# EAGLE design carte_moteurs (EAGLE 5.11)
FARNELL: 1137972
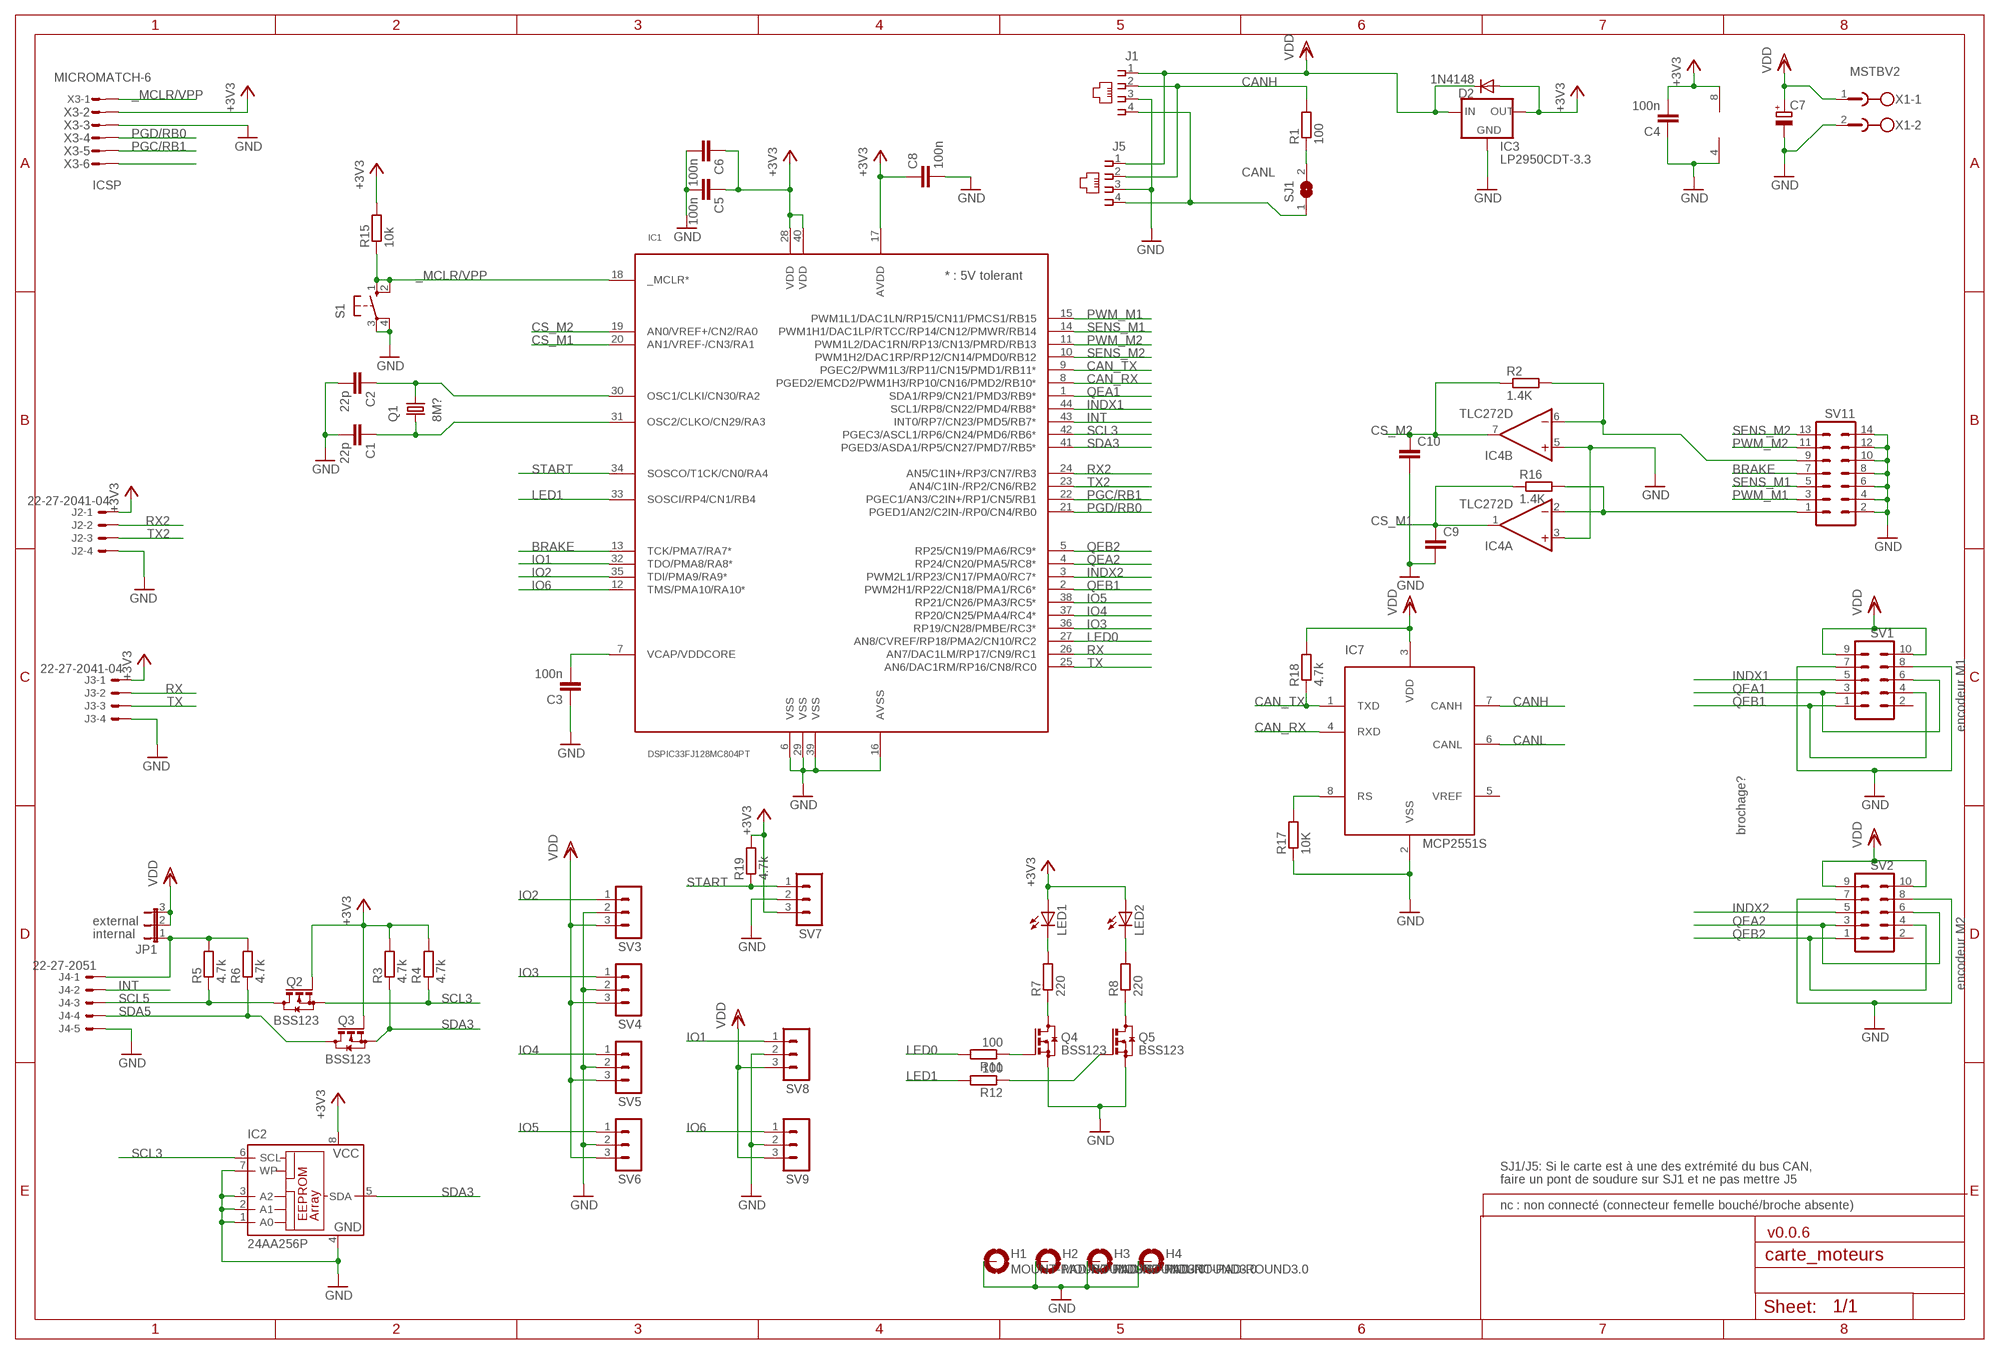
[diagram p0: schematic, sheet 1]

## Parts
C1  22p  C-EUC0603  [C0603]
C2  22p  C-EUC0603  [C0603]
C3  100n  C-EUC0603  [C0603]
C4  100n  C-EUC0603  [C0603]
C5  100n  C-EUC0603  [C0603]
C6  100n  C-EUC0603  [C0603]
C7  CPOL-EUE5-6  [E5-6]
C8  100n  C-EUC0603  [C0603]
C9  C-EUC0603  [C0603]
C10  C-EUC0603  [C0603]
D2  1N4148  1N4148DO35-7  [DO35-7]
H1  MOUNT-PAD-ROUND3.0  [3,0-PAD]
H2  MOUNT-PAD-ROUND3.0  [3,0-PAD]
H3  MOUNT-PAD-ROUND3.0  [3,0-PAD]
H4  MOUNT-PAD-ROUND3.0  [3,0-PAD]
IC1  DSPIC33FJ128MC804PT  [TQFP44]
IC2  24AA256P  [DIL8]
IC3  LP2950CDT-3.3  [DPACK]
IC4  TLC272D  [SO08]
IC7  MCP2551S  [SO-08]
J1  215876-6  [215876-6]
J2  22-27-2041-04  [6410-04]
J3  22-27-2041-04  [6410-04]
J4  22-27-2051  22-27-2051-05  [6410-05]
J5  215876-6  [215876-6]
JP1  JP2E  [JP2]
LED1  LED3MM  [LED3MM]
LED2  LED3MM  [LED3MM]
Q1  8M?  CRYSTALSM49  [SM49]
Q2  BSS123  [SOT23]
Q3  BSS123  [SOT23]
Q4  BSS123  [SOT23]
Q5  BSS123  [SOT23]
R1  100  R-EU_R0805  [R0805]
R2  1.4K  R-EU_R0805  [R0805]
R3  4.7k  R-EU_R0805  [R0805]
R4  4.7k  R-EU_R0805  [R0805]
R5  4.7k  R-EU_0204/7  [0204/7]
R6  4.7k  R-EU_0204/7  [0204/7]
R7  220  R-EU_R0805  [R0805]
R8  220  R-EU_R0805  [R0805]
R11  100  R-EU_R0805  [R0805]
R12  100  R-EU_R0805  [R0805]
R15  10k  R-EU_R0805  [R0805]
R16  1.4K  R-EU_R0805  [R0805]
R17  10K  R-EU_R0805  [R0805]
R18  4.7k  R-EU_R0805  [R0805]
R19  4.7k  R-EU_R0805  [R0805]
S1  10-XX  [B3F-10XX]
SJ1  SJ  [SJ]
SV1  MA05-2W  [MA05-2W]
SV2  MA05-2W  [MA05-2W]
SV3  MA03-1  [MA03-1]
SV4  MA03-1  [MA03-1]
SV5  MA03-1  [MA03-1]
SV6  MA03-1  [MA03-1]
SV7  MA03-1  [MA03-1]
SV8  MA03-1  [MA03-1]
SV9  MA03-1  [MA03-1]
SV11  ML14L  [ML14L]
X1  MSTBV2  [MSTBV2]
X3  MICROMATCH-6  [MICROMATCH-6]

## Nets
+3V3: C4.2 C5.1 C6.1 C8.1 D2.A IC1.17(AVDD) IC1.28(VDD) IC1.40(VDD) IC2.8(VCC) IC3.3(OUT) IC4.8(P:V+) J2.1 J3.1 LED1.A LED2.A Q2.1(G) Q3.1(G) R3.2 R4.2 R15.2 R19.2 SV7.3 X3.2
_MCLR/VPP: IC1.18(_MCLR*) R15.1 S1.1(S) S1.2(S1) X3.1
BRAKE: IC1.13(TCK/PMA7/RA7*) SV11.7
CAN_RX: IC1.8(PGED2/EMCD2/PWM1H3/RP10/CN16/PMD2/RB10*) IC7.4(RXD)
CAN_TX: IC1.9(PGEC2/PWM1L3/RP11/CN15/PMD1/RB11*) IC7.1(TXD) R18.1
CANH: IC7.7(CANH) J1.2 J5.2 R1.2
CANL: IC7.6(CANL) J1.4 J5.4 SJ1.1
CS_M1: C9.1 IC1.20(AN1/VREF-/CN3/RA1) IC4.1(A:OUT) R16.1
CS_M2: C10.1 IC1.19(AN0/VREF+/CN2/RA0) IC4.7(B:OUT) R2.1
GND: C1.2 C2.2 C3.1 C4.1 C5.2 C6.2 C7.- C8.2 C9.2 C10.2 H1.B3,0(MOUNT) H2.B3,0(MOUNT) H3.B3,0(MOUNT) H4.B3,0(MOUNT) IC1.6(VSS) IC1.16(AVSS) IC1.29(VSS) IC1.39(VSS) IC2.1(A0) IC2.2(A1) IC2.3(A2) IC2.4(GND) IC2.7(WP) IC3.4(GND) IC4.3(A:+IN) IC4.4(P:V-) IC4.5(B:+IN) IC7.2(VSS) J1.3 J2.4 J3.4 J4.5 J5.3 Q4.2(S) Q5.2(S) R17.1 S1.3(P) S1.4(P1) SV1.7 SV1.8 SV2.7 SV2.8 SV3.2 SV4.2 SV5.2 SV6.2 SV7.2 SV8.2 SV9.2 SV11.2 SV11.4 SV11.6 SV11.8 SV11.10 SV11.12 SV11.14 X1.2 X3.3
INDX1: IC1.44(SCL1/RP8/CN22/PMD4/RB8*) SV1.5
INDX2: IC1.3(PWM2L1/RP23/CN17/PMA0/RC7*) SV2.5
INT: IC1.43(INT0/RP7/CN23/PMD5/RB7*) J4.2
IO1: IC1.32(TDO/PMA8/RA8*) SV8.1
IO2: IC1.35(TDI/PMA9/RA9*) SV3.1
IO3: IC1.36(RP19/CN28/PMBE/RC3*) SV4.1
IO4: IC1.37(RP20/CN25/PMA4/RC4*) SV5.1
IO5: IC1.38(RP21/CN26/PMA3/RC5*) SV6.1
IO6: IC1.12(TMS/PMA10/RA10*) SV9.1
LED0: IC1.27(AN8/CVREF/RP18/PMA2/CN10/RC2) R11.2
LED1: IC1.33(SOSCI/RP4/CN1/RB4) R12.2
N$1: J4.1 JP1.1 R5.2 R6.2
N$2: IC4.2(A:-IN) R16.2 SV11.1
N$4: C1.1 IC1.31(OSC2/CLKO/CN29/RA3) Q1.1
N$5: Q4.3(D) R7.1
N$6: Q4.1(G) R11.1
N$9: Q5.3(D) R8.1
N$10: IC4.6(B:-IN) R2.2 SV11.9
N$11: IC7.8(RS) R17.2
N$15: C2.1 IC1.30(OSC1/CLKI/CN30/RA2) Q1.2
N$19: X3.6
N$21: Q5.1(G) R12.1
N$23: C3.2 IC1.7(VCAP/VDDCORE)
N$33: LED2.K(C) R8.2
N$34: LED1.K(C) R7.2
N$41: R1.1 SJ1.2
PGC/RB1: IC1.22(PGEC1/AN3/C2IN+/RP1/CN5/RB1) X3.5
PGD/RB0: IC1.21(PGED1/AN2/C2IN-/RP0/CN4/RB0) X3.4
PWM_M1: IC1.15(PWM1L1/DAC1LN/RP15/CN11/PMCS1/RB15) SV11.3
PWM_M2: IC1.11(PWM1L2/DAC1RN/RP13/CN13/PMRD/RB13) SV11.11
QEA1: IC1.1(SDA1/RP9/CN21/PMD3/RB9*) SV1.3 SV1.6
QEA2: IC1.4(RP24/CN20/PMA5/RC8*) SV2.3 SV2.6
QEB1: IC1.2(PWM2H1/RP22/CN18/PMA1/RC6*) SV1.1 SV1.4
QEB2: IC1.5(RP25/CN19/PMA6/RC9*) SV2.1 SV2.4
RX: IC1.26(AN7/DAC1LM/RP17/CN9/RC1) J3.2
RX2: IC1.24(AN5/C1IN+/RP3/CN7/RB3) J2.2
SCL3: IC1.42(PGEC3/ASCL1/RP6/CN24/PMD6/RB6*) IC2.6(SCL) Q2.2(S) R4.1
SCL5: J4.3 Q2.3(D) R5.1
SDA3: IC1.41(PGED3/ASDA1/RP5/CN27/PMD7/RB5*) IC2.5(SDA) Q3.2(S) R3.1
SDA5: J4.4 Q3.3(D) R6.1
SENS_M1: IC1.14(PWM1H1/DAC1LP/RTCC/RP14/CN12/PMWR/RB14) SV11.5
SENS_M2: IC1.10(PWM1H2/DAC1RP/RP12/CN14/PMD0/RB12) SV11.13
START: IC1.34(SOSCO/T1CK/CN0/RA4) R19.1 SV7.1
TX: IC1.25(AN6/DAC1RM/RP16/CN8/RC0) J3.3
TX2: IC1.23(AN4/C1IN-/RP2/CN6/RB2) J2.3
VDD: C7.+ D2.C IC3.1(IN) IC7.3(VDD) J1.1 J5.1 JP1.2 JP1.3 R18.2 SV1.9 SV1.10 SV2.9 SV2.10 SV3.3 SV4.3 SV5.3 SV6.3 SV8.3 SV9.3 X1.1
Unconnected: IC7.5(VREF) SV1.2 SV2.2

## Notes on the sheet
- ICSP
- encodeur M1
- brochage?
- external
- internal
- encodeur M2
- SJ1/J5: Si le carte est à une des extrémité du bus CAN,
- faire un pont de soudure sur SJ1 et ne pas mettre J5
- nc : non connecté (connecteur femelle bouché/broche absente)
- v0.0.6

## Library data of the parts
C1-C6 C8-C10 = rcl:C-EU: CAPACITOR, European symbol
C7 = rcl:CPOL-EU: POLARIZED CAPACITOR, European symbol
D2 = diode:1N4148: DIODE high speed (Philips)
H1-H4 = holes:MOUNT-PAD-ROUND: MOUNTING PAD, round
IC1 = microchip-dspic33:DSPIC33F*04
IC2 = microchip:24*: Serial EEPROM I2C; MF: MICROCHIP; MPN: 24AA256-I/P; OC_FARNELL: 1331294; OC_NEWARK: 92C6872
IC3 = v-reg:LP2950?*: Source: http://cache.national.com/ds/LP/LP2950.pdf
IC4 = linear:TLC272: OP AMP
IC7 = microchip:MCP2551
J1 J5 = con-amp:215876-6: AMP connector
J2 J3 = con-molex:22-?-04: CONNECTOR wire to board 2.54 mm (.1 inch) pitch header; OC_FARNELL: unknown; OC_NEWARK: unknown
J4 = con-molex:22-?-05: CONNECTOR wire to board 2.54 mm (.1 inch) pitch header; OC_FARNELL: unknown; OC_NEWARK: unknown
JP1 = jumper:JP2E: JUMPER
LED1 LED2 = led:LED: LED OSRAM: - CHIPLED LG R971, LG N971, LY N971, LG Q971, LY Q971, LO R971, LY R971 LH N974, LH R974 LS Q976, LO Q976, LY Q976 LO Q996 - Hyper CHIPLED LW Q18S LB Q993, LB Q99A, LB R99A - SideLED LS A670, LO A670, LY A670, LG A670, LP A670 LB A673, LV A673, LT A673, LW A673 LH A674 LY A675 LS A676, LA A676, LO A676, LY A676, LW A676 LS A679, LY A679, LG A679 - Hyper Micro SIDELED® LS Y876, LA Y876, LO Y876, LY Y876 LT Y87S - SmartLED LW L88C, LW L88S LB L89C, LB L89S, LG L890 LS L89K, LO L89K, LY L89K LS L896, LA L896, LO L896, LY L896 - TOPLED LS T670, LO T670, LY T670, LG T670, LP T670 LSG T670, LSP T670, LSY T670, LOP T670, LYG T670 LG T671, LOG T671, LSG T671 LB T673, LV T673, LT T673, LW T673 LH T674 LS T676, LA T676, LO T676, LY T676, LB T676, LH T676, LSB T676, LW T676 LB T67C, LV T67C, LT T67C, LS T67K, LO T67K, LY T67K, LW E67C LS E67B, LA E67B, LO E67B, LY E67B, LB E67C, LV E67C, LT E67C LW T67C LS T679, LY T679, LG T679 LS T770, LO T770, LY T770, LG T770, LP T770 LB T773, LV T773, LT T773, LW T773 LH T774 LS E675, LA E675, LY E675, LS T675 LS T776, LA T776, LO T776, LY T776, LB T776 LHGB T686 LT T68C, LB T68C - Hyper Mini TOPLED® LB M676 - Mini TOPLED Santana® LG M470 LS M47K, LO M47K, LY M47K Source: http://www.osram.convergy.de LUXEON: - LUMILED® LXK2-PW12-R00, LXK2-PW12-S00, LXK2-PW14-U00, LXK2-PW14-V00 LXK2-PM12-R00, LXK2-PM12-S00, LXK2-PM14-U00 LXK2-PE12-Q00, LXK2-PE12-R00, LXK2-PE12-S00, LXK2-PE14-T00, LXK2-PE14-U00 LXK2-PB12-K00, LXK2-PB12-L00, LXK2-PB12-M00, LXK2-PB14-N00, LXK2-PB14-P00, LXK2-PB14-Q00 LXK2-PR12-L00, LXK2-PR12-M00, LXK2-PR14-Q00, LXK2-PR14-R00 LXK2-PD12-Q00, LXK2-PD12-R00, LXK2-PD12-S00 LXK2-PH12-R00, LXK2-PH12-S00 LXK2-PL12-P00, LXK2-PL12-Q00, LXK2-PL12-R00 Source: www.luxeon.com KINGBRIGHT: KA-3528ASYC Source: www.kingbright.com
Q1 = crystal:CRYSTAL: CRYSTAL; OC_FARNELL: unknown; OC_NEWARK: unknown
Q2-Q5 = transistor-small-signal:BSS123: N-CHANNEL MOS FET
R1-R8 R11 R12 R15-R19 = rcl:R-EU_: RESISTOR, European symbol
S1 = switch-omron:10-XX: OMRON SWITCH; MPN: B3F-1000; OC_FARNELL: 176432; OC_NEWARK: 36M3542
SJ1 = jumper:SJ: SMD solder JUMPER
SV1 SV2 = con-lstb:MA05-2: PIN HEADER
SV3-SV9 = con-lstb:MA03-1: PIN HEADER; OC_FARNELL: unknown; OC_NEWARK: unknown
SV11 = con-harting-ml:ML14: HARTING; OC_FARNELL: unknown; OC_NEWARK: unknown
X1 = con-phoenix-508:MSTBV2: PHOENIX; MPN: MSTBV 2,5/2-GF-5.08; OC_FARNELL: 1792792; OC_NEWARK: 69R9845
X3 = con-amp-micromatch:MICROMATCH-6: MicroMaTch 6 7-215464-6 / 0-215464-6 Drawing Number C-215464 DDEController.pdf; MPN: 7-215464-6; OC_FARNELL: 3784630; OC_NEWARK: 19R8125

## Board
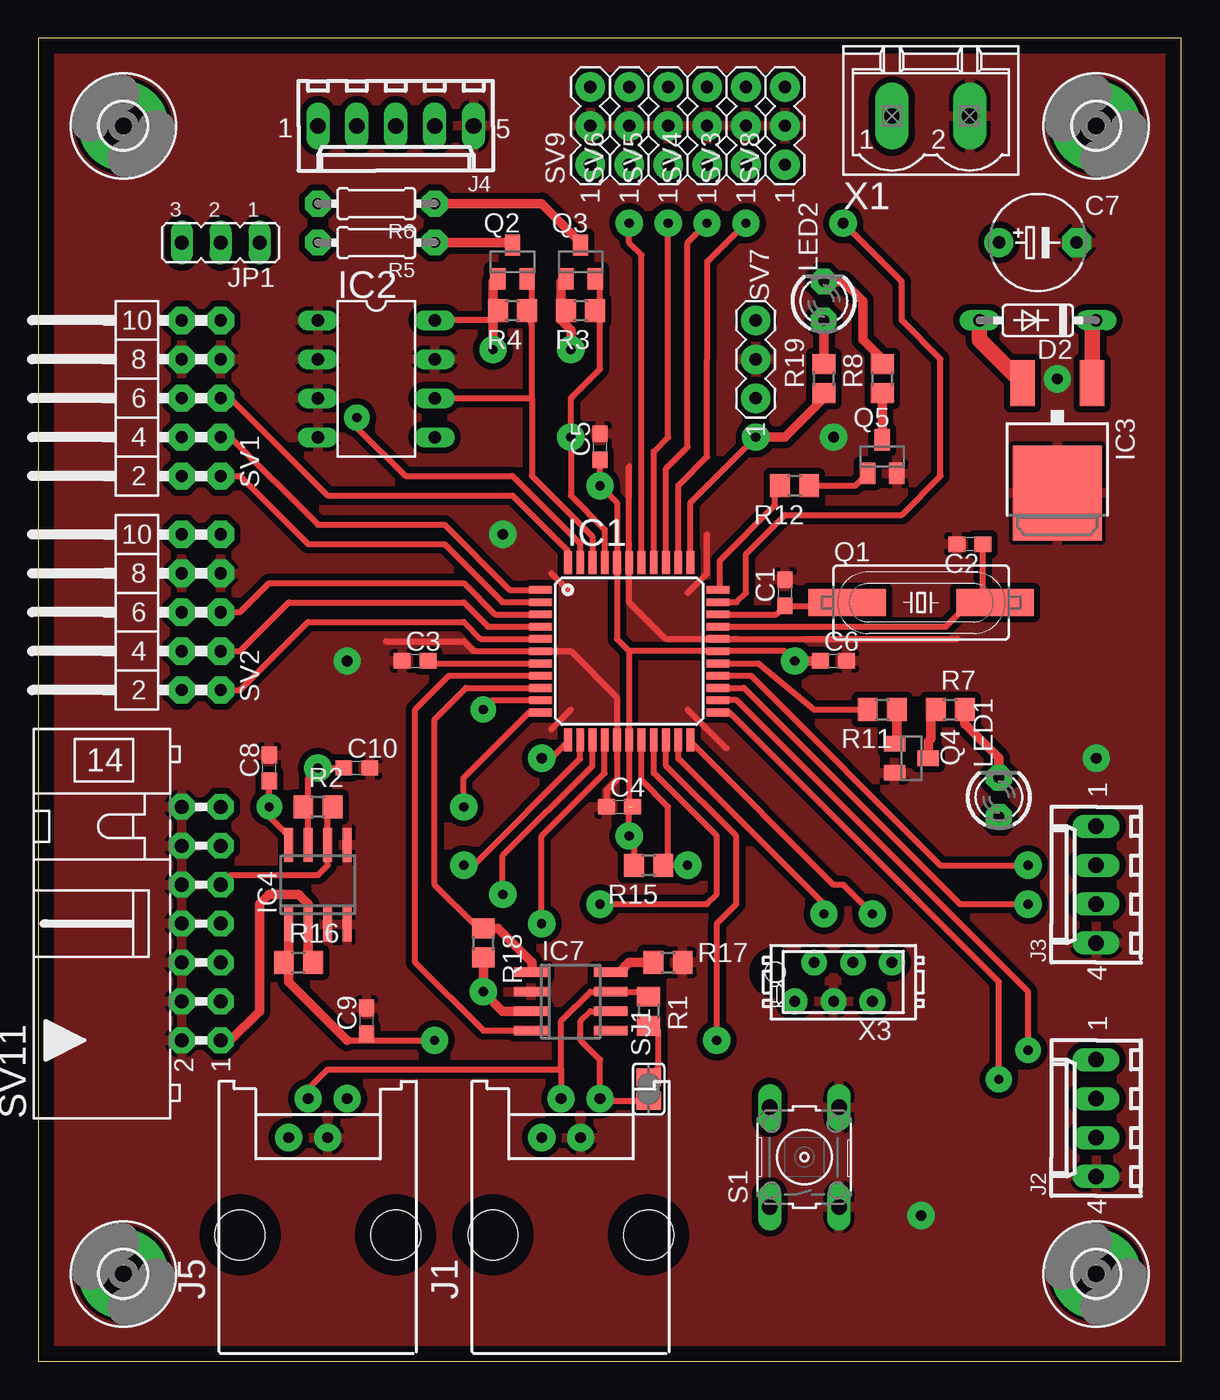
[diagram p1: board, top side]
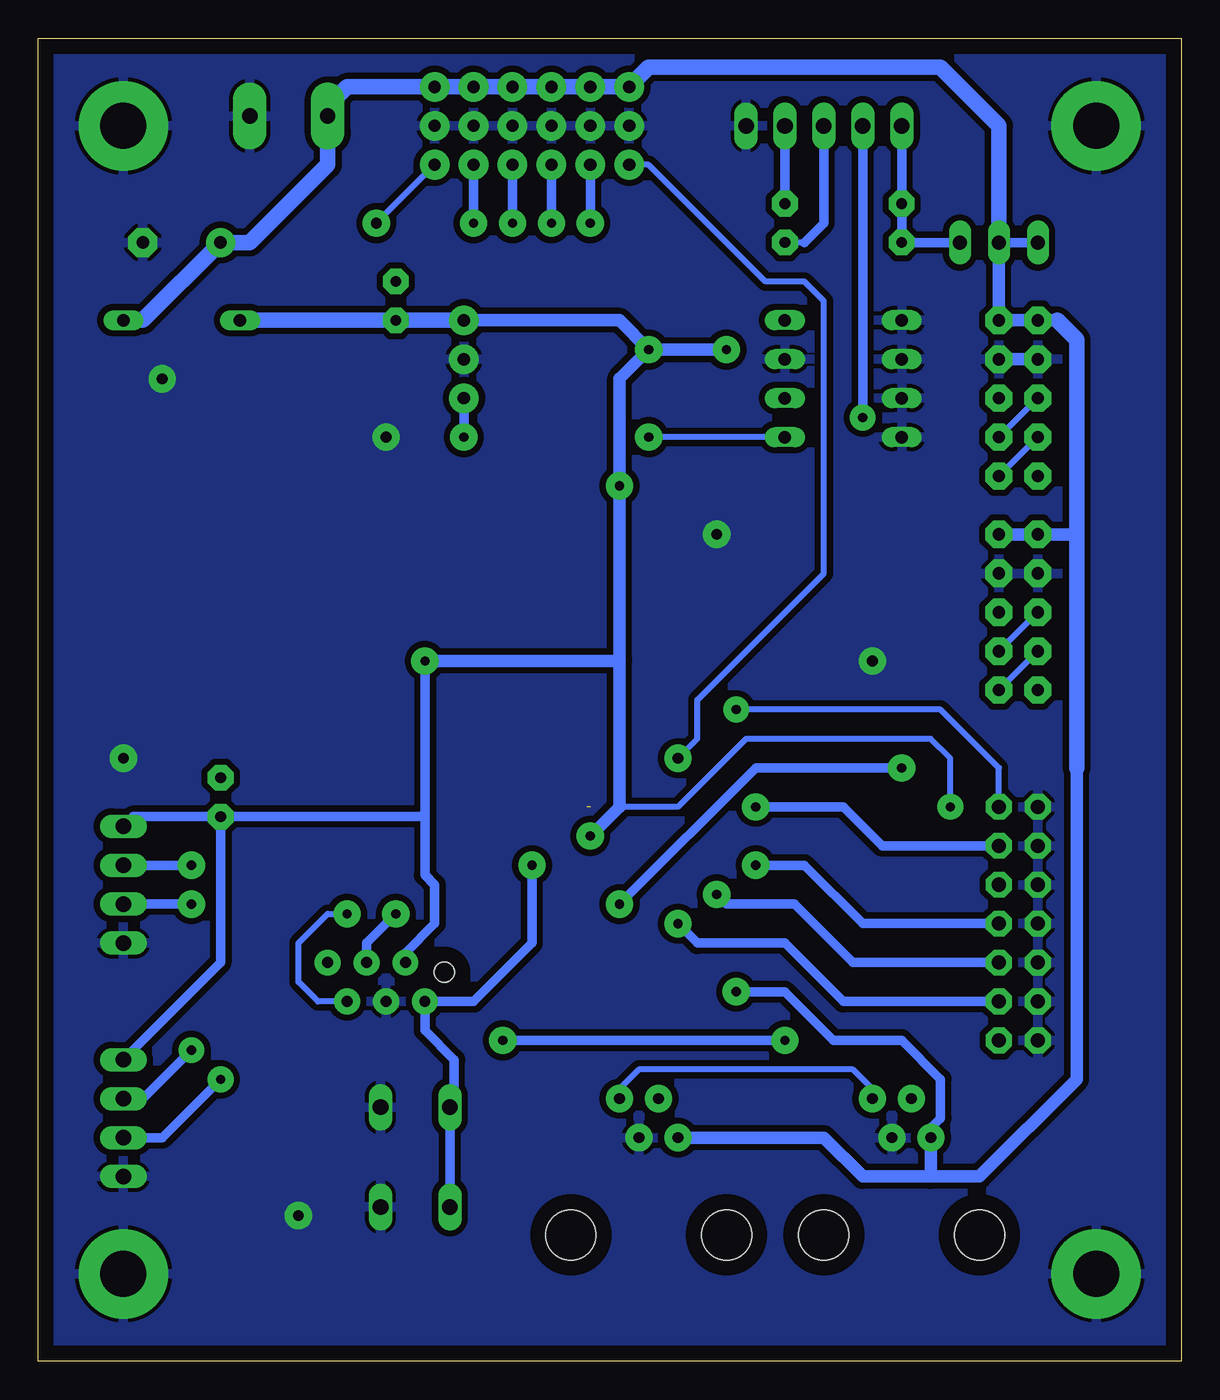
[diagram p2: board, bottom side, seen from below]

Size 74.6 x 86.34 mm. Coordinates in mm from the lower left corner, seen from the top.
Outline: 0,86.34 0,0 74.6,0 74.6,86.34 0,86.34
Copper layers (1*16): Top 0.035mm / dielectric 1.5mm / Bottom 0.035mm
Design rules "default *": minimum track width 10mil, minimum drill 0.6mm, track to track 8mil, track to pad 8mil, pad to pad 8mil, via to via 8mil, smd to smd 8mil, copper to edge 40mil, drill to drill 8mil, minimum pad ring 10mil, minimum via ring 8mil, stop-mask expansion 4mil, vias tented up to drill 0mil, thermal gap 10mil
Holes 1.3 mm at 48.09,25.39

### Footprints (pad centres in the part's own frame; a part is rotated, then mirrored left to right if it is on the bottom)
C0603 = smd 1.1 x 1: 1 -0.85,0; 2 0.85,0
E5-6 = drill 0.813 pad 1.905 round: + -2.54,0 | drill 0.813 pad 1.905 octagon: - 2.54,0
DO35-7 = drill 0.813 long: A 3.81,0; C -3.81,0
3,0-PAD = drill 3 pad 5.842 round: B3,0 0,0
TQFP44 = smd 1.5 x 0.5: 1 -5.8,4; 2 -5.8,3.2; 3 -5.8,2.4; 4 -5.8,1.6; 5 -5.8,0.8; 6 -5.8,0; 7 -5.8,-0.8; 8 -5.8,-1.6; 9 -5.8,-2.4; 10 -5.8,-3.2; 11 -5.8,-4; 23 5.8,-4; 24 5.8,-3.2; 25 5.8,-2.4; 26 5.8,-1.6; 27 5.8,-0.8; 28 5.8,0; 29 5.8,0.8; 30 5.8,1.6; 31 5.8,2.4; 32 5.8,3.2; 33 5.8,4 | smd 0.5 x 1.5: 12 -4,-5.8; 13 -3.2,-5.8; 14 -2.4,-5.8; 15 -1.6,-5.8; 16 -0.8,-5.8; 17 0,-5.8; 18 0.8,-5.8; 19 1.6,-5.8; 20 2.4,-5.8; 21 3.2,-5.8; 22 4,-5.8; 34 4,5.8; 35 3.2,5.8; 36 2.4,5.8; 37 1.6,5.8; 38 0.8,5.8; 39 0,5.8; 40 -0.8,5.8; 41 -1.6,5.8; 42 -2.4,5.8; 43 -3.2,5.8; 44 -4,5.8
DIL8 = drill 0.813 long: 1 -3.81,-3.81; 2 -1.27,-3.81; 3 1.27,-3.81; 4 3.81,-3.81; 5 3.81,3.81; 6 1.27,3.81; 7 -1.27,3.81; 8 -3.81,3.81
DPACK = smd 1.6 x 3: 1 -2.28,-4.8; 3 2.28,-4.8 | smd 5.8 x 6.2: 4 0,2.38
SO08 = smd 0.6 x 2.2: 1 -1.905,-2.6; 2 -0.635,-2.6; 3 0.635,-2.6; 4 1.905,-2.6; 5 1.905,2.6; 6 0.635,2.6; 7 -0.635,2.6; 8 -1.905,2.6
SO-08 = smd 0.6 x 2.2: 1 -1.905,-2.6; 2 -0.635,-2.6; 3 0.635,-2.6; 4 1.905,-2.6; 5 1.905,2.6; 6 0.635,2.6; 7 -0.635,2.6; 8 -1.905,2.6
215876-6 = drill 0.7 pad 1.778 round: 1 -1.905,6.35; 2 -0.635,8.89; 3 0.635,6.35; 4 1.905,8.89 | hole 3.251: -5.08,0; 5.08,0
6410-04 = drill 1.016 long: 1 3.81,0; 2 1.27,0; 3 -1.27,0; 4 -3.81,0
6410-05 = drill 1.016 long: 1 5.08,0; 2 2.54,0; 3 0,0; 4 -2.54,0; 5 -5.08,0
JP2 = drill 0.914 long: 1 -2.54,0; 2 0,0; 3 2.54,0
LED3MM = drill 0.7 pad 1.676 octagon: A -1.27,0; K 1.27,0
SM49 = smd 5.08 x 1.778: 1 -4.826,0; 2 4.826,0
SOT23 = smd 1 x 1.4: 1 -0.95,-1.1; 2 0.95,-1.1; 3 0,1.1
R0805 = smd 1.3 x 1.5: 1 -0.95,0; 2 0.95,0
0204/7 = drill 0.7 pad 1.676 octagon: 1 -3.81,0; 2 3.81,0
B3F-10XX = drill 1.016 long: 1 -3.251,2.261; 2 3.251,2.261; 3 -3.251,-2.261; 4 3.251,-2.261
SJ = smd 1.168 x 1.6: 1 -0.762,0; 2 0.762,0
MA05-2W = drill 0.8 pad 1.778 octagon: 1 -5.08,-1.27; 2 -5.08,1.27; 3 -2.54,-1.27; 4 -2.54,1.27; 5 0,-1.27; 6 0,1.27; 7 2.54,-1.27; 8 2.54,1.27; 9 5.08,-1.27; 10 5.08,1.27
MA03-1 = drill 0.8 pad 1.93 round: 1 -2.54,0; 2 0,0; 3 2.54,0
ML14L = drill 0.914 pad 1.676 octagon: 1 -7.62,-1.27; 2 -7.62,1.27; 3 -5.08,-1.27; 4 -5.08,1.27; 5 -2.54,-1.27; 6 -2.54,1.27; 7 0,-1.27; 8 0,1.27; 9 2.54,-1.27; 10 2.54,1.27; 11 5.08,-1.27; 12 5.08,1.27; 13 7.62,-1.27; 14 7.62,1.27
MSTBV2 = drill 1 pad 2.184 long: 1 -2.54,0; 2 2.54,0
MICROMATCH-6 = drill 0.7 pad 1.676 round: 1 3.175,1.27; 2 1.905,-1.27; 3 0.635,1.27; 4 -0.635,-1.27; 5 -1.905,1.27; 6 -3.175,-1.27

### Placement (x,y rotation side)
C1  48.73,50.15 90 top
C2  60.8,53.32 180 top
C3  24.6,45.7 0 top
C4  37.94,36.18 0 top
C5  36.66,59.67 90 top
C6  51.91,45.7 0 top
C7  65.24,73.01 0 top
C8  15.08,38.72 90 top
C9  21.42,22.21 90 top
C10  20.79,38.72 0 top
D2  65.24,67.93 180 top
H1  5.55,80.63 270 top
H2  69.05,5.7 270 top
H3  69.05,80.63 270 top
H4  5.55,5.7 270 top
IC1  38.57,46.34 0 top
IC2  22.06,64.12 270 top
IC3  66.51,59.04 180 top
IC4  18.25,31.1 0 top
IC7  34.76,23.48 270 top
J1  34.76,8.24 0 top
J2  69.05,15.86 90 top
J3  69.05,31.1 90 top
J4  23.33,80.63 180 top
J5  18.25,8.24 0 top
JP1  11.9,73.01 180 top
LED1  62.7,36.81 90 top
LED2  51.27,69.2 90 top
Q1  57.62,49.52 0 top
Q2  30.95,71.74 0 top
Q3  35.39,71.74 0 top
Q4  56.98,39.35 270 top
Q5  55.08,59.04 0 top
R1  39.84,22.85 90 top
R2  18.25,36.18 0 top
R3  35.39,68.56 180 top
R4  30.95,68.56 180 top
R5  22.06,73.01 180 top
R6  22.06,75.55 180 top
R7  59.52,42.53 0 top
R8  55.08,64.12 90 top
R11  55.08,42.53 180 top
R12  49.37,57.13 180 top
R15  39.84,32.37 180 top
R16  16.98,26.02 0 top
R17  41.11,26.02 180 top
R18  29.04,27.29 270 top
R19  51.27,64.12 90 top
S1  50,13.32 90 top
SJ1  39.84,17.77 90 top
SV1  10.63,62.85 90 top
SV2  10.63,48.88 90 top
SV3  46.19,80.63 90 top
SV4  43.65,80.63 90 top
SV5  41.11,80.63 90 top
SV6  38.57,80.63 90 top
SV7  46.82,65.39 90 top
SV8  48.73,80.63 90 top
SV9  36.03,80.63 90 top
SV11  10.63,28.56 90 top
X1  58.25,81.27 0 top
X3  52.54,24.75 180 top

### Tracks (layer width: path | path; a pad name or v marks a point on that pad's centre or on a via)
+3V3  (via drill 0.6 pad 1.68, 0.6 pad 1.78)  (1 unrouted)
  Top 0.406: 38.57,46.34 37.77,47.14 IC1.40 37.77,56.03 v36.66,57.13 C5.1 | 38.57,46.34 IC1.17 38.57,36.39 | 38.57,46.34 IC1.28 48.73,46.34 v49.37,45.7 | 29.68,67.93 30,68.25 | 34.45,68.25 34.12,67.93 R3.2 | Q2.1 29.85,70.64 29.68,70.47 | Q3.1 34.3,70.64 34.12,70.47 | 29.68,67.93 R4.2 | R15.2 38.89,33.95 v38.57,34.27 38.57,36.18 | 29.68,67.93 IC2.8 | IC4.8 16.34,34.27 15.08,35.54 v15.08,36.18 C8.1
  Top 0.61: 29.68,70.47 29.68,67.93 v29.68,66.03 | 34.12,70.47 34.12,67.93 34.76,67.3 v34.76,66.03 | v49.37,45.7 C6.1 | LED2.A R19.2
  Top 1.016: IC3.3 64.23,63.86 61.43,66.66 D2.A
  Bottom 0.406: v15.08,36.18 15.08,39.35 16.34,40.62 28.41,40.62 32.85,36.18 36.66,36.18
  Bottom 0.61: v49.37,45.7 49.37,35.54 | 49.37,35.54 49.37,31.73 48.73,31.1 48.73,28.56 50.63,26.66 X3.2 | J2.1 62.7,26.02 LED1.A | 49.37,35.54 LED1.A | J3.1 68.41,35.54 LED1.A
  Bottom 0.813: v38.57,34.27 36.66,36.18 36.66,45.7 | 36.66,45.7 v36.66,57.13 36.66,64.12 v34.76,66.03 | 36.66,45.7 v49.37,45.7 | v34.76,66.03 v29.68,66.03 | SV7.3 36.66,67.93 v34.76,66.03
  Bottom 1.016: SV7.3 LED2.A D2.A
_MCLR/VPP  (via drill 0.6 pad 1.78)
  Top 0.406: IC1.18 39.37,37.92 41.11,36.18 41.11,32.69 | v42.38,32.37 41.11,32.37 41.11,32.69 | 41.11,32.69 R15.1
  Bottom 0.406: 47.74,16.85 47.46,17.13
  Bottom 0.61: S1.1 S1.2 47.74,16.85 | v42.38,32.37 42.38,27.29 46.19,23.48 X3.1 49.37,21.57 47.46,19.67 47.46,17.13
BRAKE  (via drill 0.6 pad 1.78)
  Top 0.406: IC1.13 35.37,39.33 28.41,32.37 v27.77,32.37
  Bottom 0.61: SV11.7 20.79,28.56 24.6,32.37 v27.77,32.37
CAN_RX
  Top 0.406: IC7.4 29.04,21.57 24.6,26.02 24.6,42.53 26.81,44.74 IC1.8
CAN_TX
  Top 0.406: R18.1 28.98,28.3 28.66,28.3 25.87,31.1 25.87,41.89 27.91,43.94 IC1.9 | 32.22,25.45 IC7.1
  Top 0.61: R18.1 30,28.24 32.22,26.02 32.22,25.45 32.22,25.39
CANH
  Top 0.406: R1.2 39.52,24.12 IC7.7 36.03,24.12 34.12,22.21 34.12,19.04 | 34.12,19.04 18.88,19.04 17.61,17.77 J5.2 | 34.12,19.04 J1.2
CANL
  Top 0.406: IC7.6 36.03,22.85 35.39,22.21 35.39,20.94 36.66,19.67 J1.4 36.79,17 SJ1.1
  Bottom 0.406: J5.4 20.15,17.77 21.42,19.04 35.39,19.04 36.66,17.77 J1.4
CS_M1  (via drill 0.6 pad 1.78)
  Top 0.406: 16.34,25.7 R16.1 | IC1.20 40.97,38.86 45.55,34.27 45.55,29.83 44.28,28.56 v44.28,20.94 | 21.42,20.94 v25.87,20.94 | 21.21,20.94 C9.1 21.42,20.94 | 20.15,20.94 21.21,20.94 | 21.21,20.94 21.42,20.94
  Top 0.61: IC4.1 16.34,25.7 16.34,24.75 20.15,20.94
  Bottom 0.61: v25.87,20.94 v44.28,20.94
CS_M2  (via drill 0.6 pad 1.78)
  Top 0.406: IC4.7 17.61,35.86 | 17.61,35.86 R2.1 | IC1.19 40.17,38.39 44.28,34.27 44.28,30.46 43.65,29.83 v36.66,29.83 | 17.61,35.86 17.61,38.09 v18.25,38.72 C10.1
  Bottom 0.61: v18.25,38.72 27.77,38.72 v36.66,29.83
GND  (via drill 0.7 pad 1.78)
  Top 0.406: 59.99,47.14 IC1.29 40.95,47.14 38.57,49.52 IC1.39 38.57,58.4 | 42.38,50.15 43.65,51.42 43.65,53.96 | 44.92,39.99 42.38,42.53 | 34.76,50.15 33.49,51.42 | 34.76,42.53 33.49,41.26 | 22.7,46.97 27.77,46.97 28.41,46.34 IC1.6 34.76,46.34 37.77,43.33 IC1.16 37.77,37.92 37.09,37.23 C4.1
  Bottom 0.813: SV1.8 SV1.7
  other vias: 20.15,45.7 69.05,39.35 57.62,9.51 66.51,64.12 51.91,60.31 30.31,53.96
  pour Top (isolate 0.406): 74.13,85.71 74.13,0.62 0.47,0.62 0.47,85.71
  pour Bottom (isolate 0.406): 0.47,85.71 74.13,85.71 74.13,0.62 0.47,0.62
INDX1
  Top 0.406: IC1.44 34.57,52.88 30.95,56.5 18.88,56.5 12.54,62.85 SV1.5
INDX2
  Top 0.406: IC1.3 29.82,48.74 27.77,50.78 15.08,50.78 13.17,48.88 SV2.5
INT  (via drill 0.6 pad 1.68)
  Top 0.406: IC1.43 35.37,53.35 30.95,57.77 23.96,57.77 20.79,60.95 v20.79,61.58
  Bottom 0.61: v20.79,61.58 J4.2
IO1  (via drill 0.7 pad 1.78)
  Top 0.406: IC1.32 45.58,49.54 46.19,50.15 46.19,52.69 48.73,55.23 56.35,55.23 58.89,57.77 58.89,65.39 56.35,67.93 56.35,70.47 v52.54,74.28
  Bottom 0.406: v52.54,74.28 SV8.1
IO2  (via drill 0.6 pad 1.78)
  Top 0.406: v46.19,74.28 43.67,71.77 43.65,59.04 41.77,57.16 IC1.35
  Bottom 0.61: v46.19,74.28 SV3.1
IO3  (via drill 0.6 pad 1.78)
  Top 0.406: IC1.36 40.97,58.27 42.38,59.67 42.38,73.01 v43.65,74.28
  Bottom 0.61: v43.65,74.28 SV4.1
IO4  (via drill 0.6 pad 1.78)
  Top 0.406: IC1.37 40.17,59.37 41.11,60.31 v41.11,74.28
  Bottom 0.61: v41.11,74.28 SV5.1
IO5  (via drill 0.6 pad 1.78)
  Top 0.406: v38.57,74.28 38.57,73.01 39.37,72.21 IC1.38
  Bottom 0.61: v38.57,74.28 SV6.1
IO6  (via drill 0.7 pad 1.78)
  Top 0.406: IC1.12 34.57,40.43 33.49,39.35 v32.85,39.35
  Bottom 0.406: SV9.1 34.76,78.09 27.14,70.47 24.6,70.47 23.33,69.2 23.33,51.42 31.58,43.16 31.58,40.62 v32.85,39.35
LED0
  Top 0.406: IC1.27 46.99,45.54 50.63,42.53 R11.2
LED1
  Top 0.406: IC1.33 44.48,50.34 44.48,52.24 48.09,55.86 48.09,56.81 R12.2 48.18,57.37
N$1
  Bottom 0.61: J4.1 R6.2 R5.2 JP1.1
N$2
  Top 0.406: 17.61,26.34 R16.2 18.25,25.7
  Top 0.61: 17.61,26.34 IC4.2 17.61,29.83 16.98,30.46 15.08,30.46 14.44,29.83 14.44,22.85 12.54,20.94 SV11.1
N$4
  Top 0.406: 52.54,50.15 52.4,50.01 52.4,49.38 51.77,49.38 51.59,49.2 51.48,49.3 C1.1 48.17,48.74 IC1.31 | 52.54,50.15 Q1.1 | 52.54,50.15 51.69,49.93
N$5
  Top 0.61: Q4.3 58.09,40.45 58.25,40.62 58.25,42.21 R7.1
N$6
  Top 0.61: R11.1 56.03,40.45 Q4.1
N$9
  Top 0.61: Q5.3 R8.1
N$10
  Top 0.406: 19.52,36.5 R2.2 18.88,35.86 IC4.6 18.88,32.37 18.25,31.73 12.54,31.73 SV11.9
N$11
  Top 0.406: IC7.8 37.99,25.45
  Top 0.61: 37.99,25.45 38.57,26.02 R17.2
N$15
  Top 0.406: IC1.30 59.22,47.94 61.43,50.15 62.06,50.15 Q1.2 63.08,48.88 63.97,48.88 64.19,49.09 62.06,49.52 61.64,49.93 C2.1
N$21
  Top 0.406: 50.63,57.13 53.32,57.13 Q5.1
  Top 0.61: R12.1 50.63,57.13
N$23
  Top 0.406: IC1.7 25.7,45.54 25.23,45.7 C3.2
N$33
  Top 0.61: R8.2 55.08,65.39 53.81,66.66 53.81,69.2 52.54,70.47 LED2.K
N$34
  Top 0.61: R7.2 60.48,41.57 62.7,39.35 LED1.K
N$41
  Top 0.406: 39.84,22.21 R1.1 40.16,21.89 40.48,21.57 40.48,19.16 SJ1.2
PGC/RB1  (via drill 0.6 pad 1.78)
  Top 0.406: IC1.22 42.57,40.43 51.91,31.1 52.54,31.1 v54.45,29.2
  Bottom 0.406: X3.5 56.35,23.48 57.62,24.75 57.62,27.29 55.71,29.2 v54.45,29.2
PGD/RB0  (via drill 0.6 pad 1.78)
  Top 0.406: IC1.21 41.77,39.33 51.27,29.83 v51.27,29.2
  Bottom 0.61: X3.4 53.17,27.29 v51.27,29.2
PWM_M1  (via drill 0.6 pad 1.78)
  Top 0.406: v32.85,28.56 32.85,34.27 36.97,38.39 IC1.15
  Bottom 0.61: v32.85,28.56 31.58,27.29 25.87,27.29 22.06,23.48 SV11.3
PWM_M2  (via drill 0.6 pad 1.78)
  Top 0.406: v27.77,36.18 27.75,38.06 32.03,42.34 IC1.11
  Bottom 0.61: SV11.11 19.52,33.64 22.06,36.18 v27.77,36.18
QEA1
  Top 0.406: IC1.1 30.76,50.34 26.5,54.59 18.25,54.59 12.54,60.31 SV1.3
  Bottom 0.406: SV1.6 SV1.3
QEA2
  Top 0.406: IC1.4 29.35,47.94 27.77,49.52 16.34,49.52 13.17,46.34 SV2.3
  Bottom 0.406: SV2.6 SV2.3
QEB1
  Top 0.406: IC1.2 30.29,49.54 26.5,53.32 17.61,53.32 13.17,57.77 SV1.1
  Bottom 0.406: SV1.4 SV1.1
QEB2
  Top 0.406: IC1.5 28.88,47.14 27.77,48.24 17.61,48.24 13.17,43.8 SV2.1
  Bottom 0.406: SV2.4 SV2.1
RX  (via drill 0.6 pad 1.78)
  Top 0.406: v64.61,32.37 58.89,32.37 46.52,44.74 IC1.26
  Bottom 0.61: v64.61,32.37 J3.2
RX2  (via drill 0.6 pad 1.68)
  Top 0.406: v64.61,20.3 64.61,24.12 45.58,43.14 IC1.24
  Bottom 0.61: J2.2 67.78,17.13 v64.61,20.3
SCL3
  Top 0.406: IC1.42 36.17,53.82 32.22,57.77 32.22,62.85 | 32.22,62.85 32.22,67.61 R4.1 32.22,68.25 32.22,70.47 32.05,70.64 Q2.2 | IC2.6 32.22,62.85
SCL5
  Top 0.406: 30.95,73.01 Q2.3
  Top 0.61: R5.1 30.95,73.01
  Bottom 0.406: 24.6,73.01 R5.1
  Bottom 0.61: 24.6,73.01 23.33,74.28 J4.3
SDA3  (via drill 0.6 pad 1.78)
  Top 0.406: 36.66,67.93 36.34,68.25 | Q3.2 36.49,70.64 36.66,70.47 36.66,67.93 | IC1.41 36.97,54.29 34.76,56.5 v34.76,60.31 34.76,62.85 36.66,64.76 36.66,67.93 | 36.66,67.93 R3.1
  Bottom 0.406: IC2.5 v34.76,60.31
SDA5
  Top 0.406: 35.39,73.01 Q3.3
  Top 0.61: R6.1 32.85,75.55 35.39,73.01
  Bottom 0.61: R6.1 J4.4
SENS_M1  (via drill 0.6 pad 1.78)
  Top 0.406: v30.31,30.46 30.31,33 36.17,38.86 IC1.14
  Bottom 0.61: v30.31,30.46 29.68,29.83 25.23,29.83 21.42,26.02 SV11.5
SENS_M2  (via drill 0.6 pad 1.68)
  Top 0.406: v29.04,42.53 29.65,43.14 IC1.10
  Bottom 0.406: v29.04,42.53 15.71,42.53 11.9,38.72 SV11.13
START  (via drill 0.6 pad 1.78)
  Top 0.406: IC1.34 42.57,56.05 v46.82,60.31 | 51.27,62.85 R19.1
  Top 0.61: v46.82,60.31 48.73,60.31 51.27,62.85
  Bottom 0.61: v46.82,60.31 SV7.1
TX  (via drill 0.6 pad 1.78)
  Top 0.406: v64.61,29.83 60.16,29.83 46.05,43.94 IC1.25
  Bottom 0.61: v64.61,29.83 J3.3
TX2  (via drill 0.6 pad 1.68)
  Top 0.406: IC1.23 45.11,42.34 62.7,24.75 v62.7,18.4
  Bottom 0.61: v62.7,18.4 66.51,14.59 J2.3
VDD  (via drill 0.6 pad 1.78)
  Top 0.61: IC7.3 30.31,22.85 v29.04,24.12 R18.2
  Top 1.016: D2.C 68.41,67.93 68.79,67.56 IC3.1
  Bottom 0.61: JP1.2 JP1.3 | J5.1 16.34,15.22 15.71,15.86 15.71,18.4 18.25,20.94 22.7,20.94 25.87,24.12 v29.04,24.12
  Bottom 0.813: 6.82,38.72 6.82,18.4 13.17,12.05 16.34,12.05 | 16.34,12.05 J5.1 | 16.34,12.05 20.79,12.05 23.33,14.59 J1.1 | 8.09,67.93 SV1.10 SV1.9 JP1.2 | SV2.9 SV2.10 6.82,53.96
  Bottom 1.016: 8.09,67.93 6.82,66.66 6.82,53.96 6.82,38.72 | JP1.2 11.9,80.63 15.71,84.44 34.76,84.44 SV9.3 SV6.3 SV5.3 SV4.3 SV3.3 SV8.3 54.45,83.17 55.71,81.9 X1.1 55.71,78.09 60.8,73.01 C7.+ 67.78,67.93 D2.C